# EAGLE design Arduino LCD Clock rev 2 (EAGLE 6.5.0)
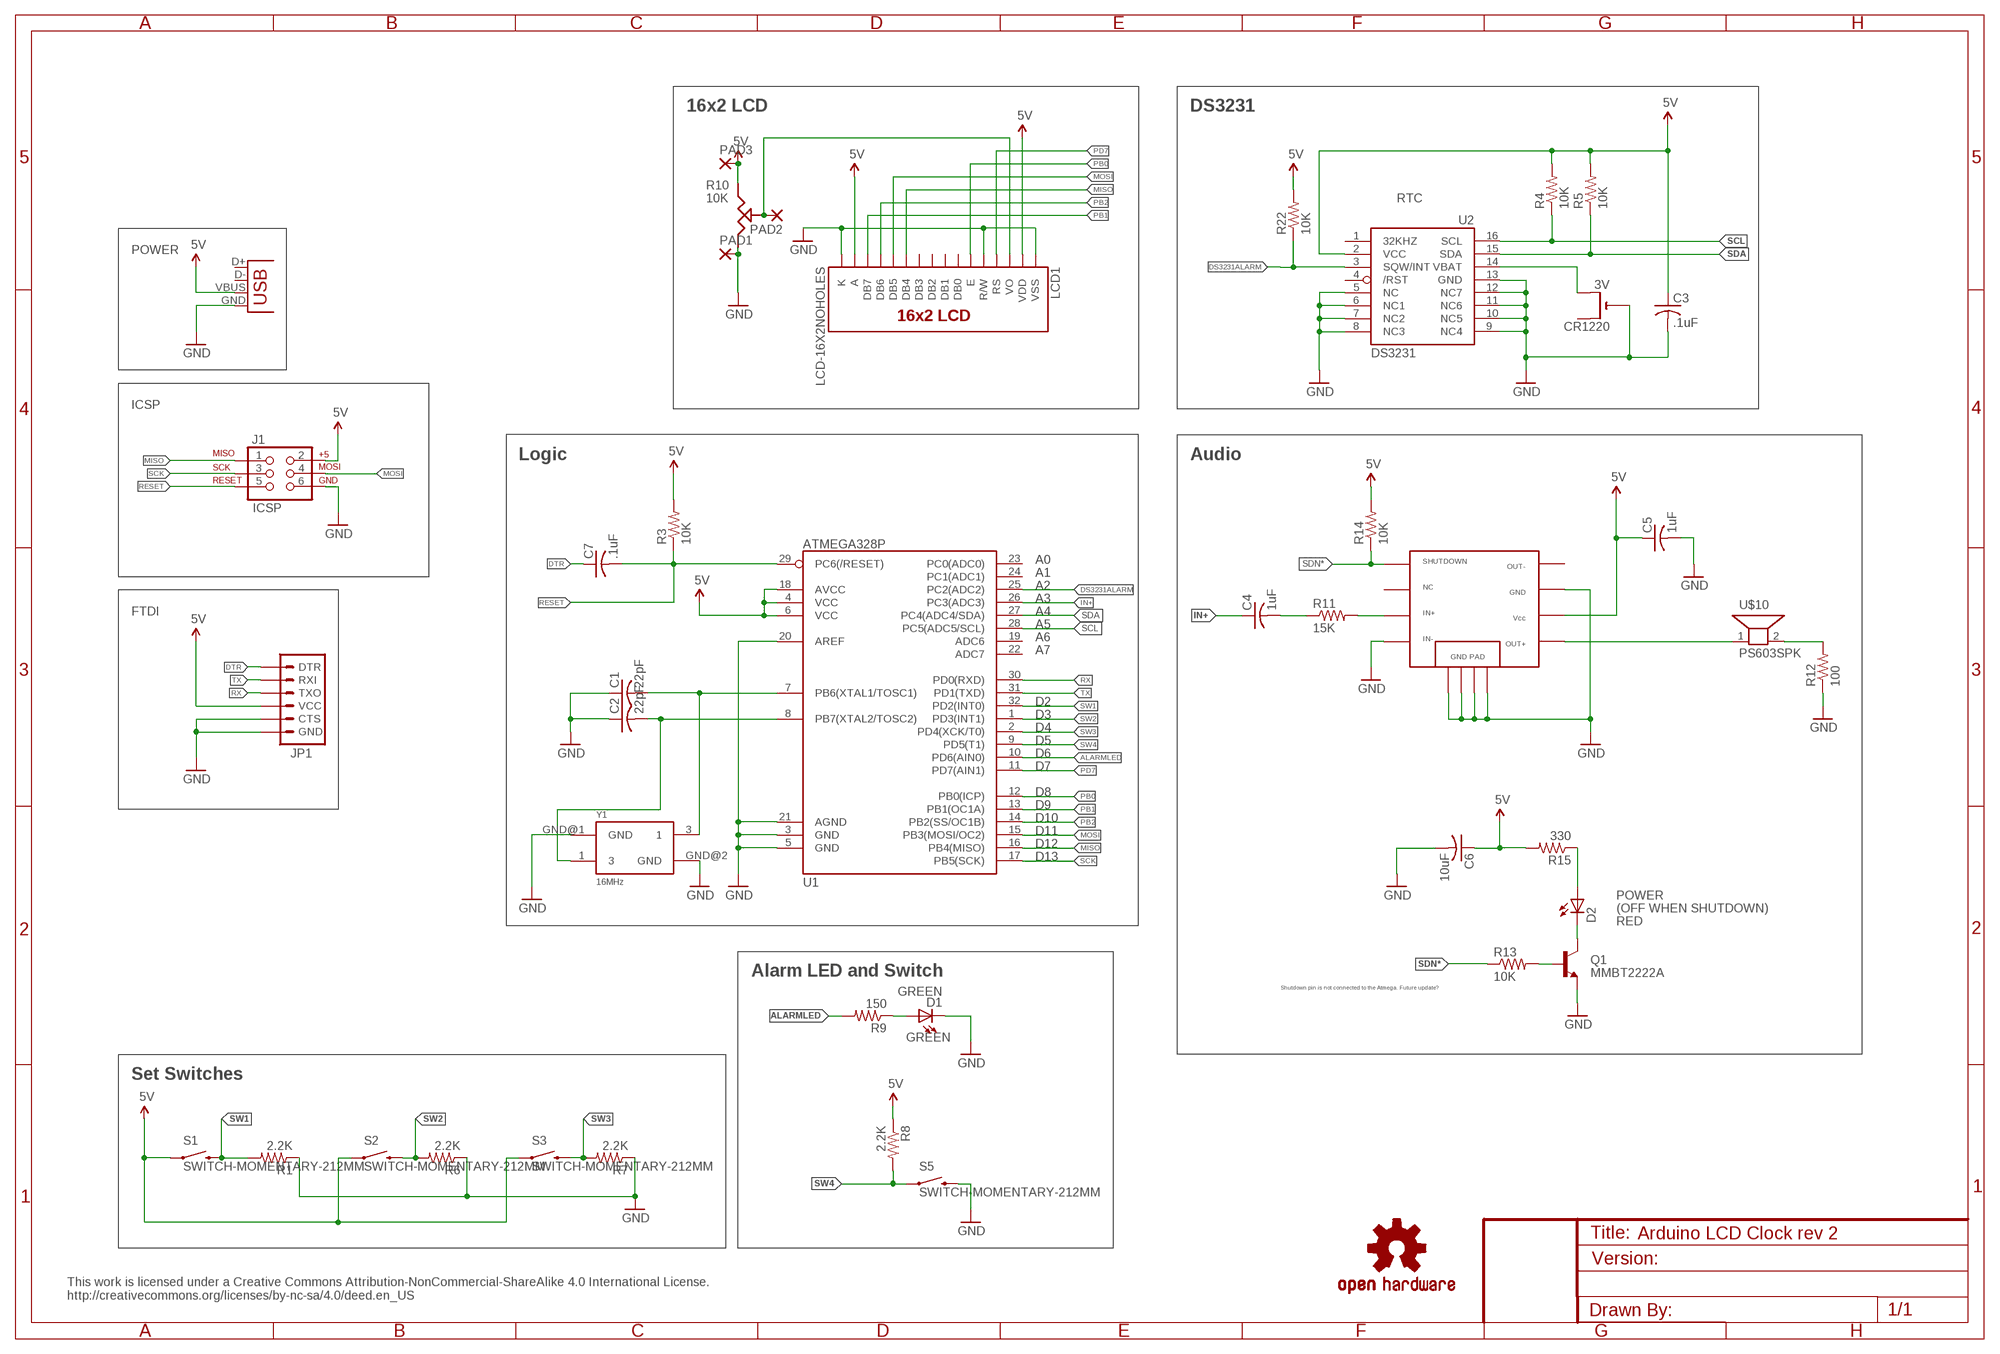
[diagram p0: schematic, sheet 1]

## Parts
C1  22pF  C-USC0805K  [C0805K]
C2  22pF  C-USC0805K  [C0805K]
C3  .1uF  C-USC0805K  [C0805K]
C4  1uF  C-USC0805K  [C0805K]
C5  1uF  C-USC0805K  [C0805K]
C6  10uF  C-USC0805K  [C0805K]
C7  .1uF  C-USC0805K  [C0805K]
CR1220  3V  CR1220THM  [CR1220-THM]
D1  GREEN  LED-RED1206  [LED-1206]
D2  LED-RED1206  [LED-1206]
J1  ICSP  AVR_SPI_PRG_6PTH  [2X3]
JP1  ARDUINO_SERIAL_PROGRAMSMD  [1X06-SMD]
JP3  (POWER ONLY)  USBPTH-VERTICAL  [USB-B-PTH-VERTICAL]
LCD1  LCD-16X2NOHOLES  [LCD-16X2_NOHOLES]
PAD1  SMD2  [SMD1,27-2,54]
PAD2  SMD2  [SMD1,27-2,54]
PAD3  SMD2  [SMD1,27-2,54]
Q1  MMBT2222A  TRANSISTOR_NPNSOT23-3  [SOT23-3]
R1  2.2K  R-US_R0805  [R0805]
R3  10K  R-US_R0805  [R0805]
R4  10K  R-US_R0805  [R0805]
R5  10K  R-US_R0805  [R0805]
R6  2.2K  R-US_R0805  [R0805]
R7  2.2K  R-US_R0805  [R0805]
R8  2.2K  R-US_R0805  [R0805]
R9  150  R-US_R0805  [R0805]
R11  15K  R-US_R0805  [R0805]
R12  100  R-US_R0805  [R0805]
R13  10K  R-US_R0805  [R0805]
R14  10K  R-US_R0805  [R0805]
R15  330  R-US_R0805  [R0805]
R22  10K  R-US_R0805  [R0805]
S1  SWITCH-MOMENTARY-212MM  [TACTILE-PTH-12MM]
S2  SWITCH-MOMENTARY-212MM  [TACTILE-PTH-12MM]
S3  SWITCH-MOMENTARY-212MM  [TACTILE-PTH-12MM]
S5  SWITCH-MOMENTARY-212MM  [TACTILE-PTH-12MM]
U1  ATMEGA328P  ATMEGA328_SMT  [TQFP32-08]
U2  DS3231  DS3231/SO  [SO16W]
U3  TPA2005  [MSOP8]
U$2  OSHW-LOGOM  [OSHW-LOGO-M]
U$6  PVG3A103C01R00_TRIMPOT  [PVG3A103C01R00_TRIMPOT]
U$10  PS603SPK  [PS603]
Y1  16MHz  OSCILLATOR5X3  [CRYSTAL-SMD-5X3]

## Nets
5V: C3.1 C5.1 C6.1 J1.2 JP1.4(VCC) JP3.VBUS LCD1.2(VDD) LCD1.15(A) PAD3.1(P) R3.2 R4.2 R5.2 R8.1 R14.2 R15.2 R22.2 S1.1 S2.1 S3.1 U1.4(VCC) U1.6(VCC) U1.18(AVCC) U2.2(VCC) U3.6 U$6.1$(IN) U$6.1(IN)
ALARMLED: R9.2 U1.10(PD6(AIN0))
DS3231ALARM: R22.1 U1.25(PC2(ADC2)) U2.3(SQW/INT)
DTR: C7.1 JP1.1(DTR)
GND: C1.1 C2.1 C3.2 C5.2 C6.2 CR1220.- D1.C J1.6 JP1.5(CTS) JP1.6(GND) JP3.GND LCD1.1(VSS) LCD1.5(R/W) LCD1.16(K) PAD1.1(P) Q1.2(E) R1.1 R6.1 R7.1 R12.1 S5.3 U1.3(GND) U1.5(GND) U1.20(AREF) U1.21(AGND) U2.5(NC) U2.6(NC1) U2.7(NC2) U2.8(NC3) U2.9(NC4) U2.10(NC5) U2.11(NC6) U2.12(NC7) U2.13(GND) U3.4 U3.7 U3.A U3.B U3.C U3.D U$6.3$(GND) U$6.3(GND) Y1.GND@1(GND) Y1.GND@2(GND)
IN+: C4.1 U1.26(PC3(ADC3))
IN+AMP: R11.2 U3.3
MISO: J1.1 LCD1.11(DB4) U1.16(PB4(MISO))
MOSI: J1.4 LCD1.12(DB5) U1.15(PB3(MOSI/OC2))
N$1: CR1220.+2(+1) U2.14(VBAT)
N$2: U3.5 U$10.1
N$13: LCD1.3(VO) PAD2.1(P) U$6.2!(OUT) U$6.2(OUT)
N$20: R12.2 U$10.2
N$24: D1.A R9.1
N$25: D2.A R15.1
N$26: Q1.1(B) R13.2
N$27: D2.C Q1.3(C)
N$28: C4.2 R11.1
N$30: C1.2 U1.7(PB6(XTAL1/TOSC1)) Y1.3
N$31: C2.2 U1.8(PB7(XTAL2/TOSC2)) Y1.1
PB0: LCD1.6(E) U1.12(PB0(ICP))
PB1: LCD1.14(DB7) U1.13(PB1(OC1A))
PB2: LCD1.13(DB6) U1.14(PB2(SS/OC1B))
PD7: LCD1.4(RS) U1.11(PD7(AIN1))
RESET: C7.2 J1.5 R3.1 U1.29(PC6(/RESET))
RX: JP1.3(TXO) U1.30(PD0(RXD))
SCK: J1.3 U1.17(PB5(SCK))
SCL: R4.1 U1.28(PC5(ADC5/SCL)) U2.16(SCL)
SDA: R5.1 U1.27(PC4(ADC4/SDA)) U2.15(SDA)
SDN*: R13.1 R14.1 U3.1
SW1: R1.2 S1.3 U1.32(PD2(INT0))
SW2: R6.2 S2.3 U1.1(PD3(INT1))
SW3: R7.2 S3.3 U1.2(PD4(XCK/T0))
SW4: R8.2 S5.1 U1.9(PD5(T1))
TX: JP1.2(RXI) U1.31(PD1(TXD))
Unconnected: CR1220.+1(+) JP3.D+ JP3.D- LCD1.7(DB0) LCD1.8(DB1) LCD1.9(DB2) LCD1.10(DB3) U1.19(ADC6) U1.22(ADC7) U1.23(PC0(ADC0)) U1.24(PC1(ADC1)) U2.1(32KHZ) U2.4(/RST) U3.8 U3.NC

## Notes on the sheet
- 16x2 LCD | DS3231
- R10
- 10K | RTC
- POWER
- ICSP
- Logic | Audio
- A0
- A1
- A2
- A3
- FTDI | A4
- A5
- A6
- A7
- D2
- D3
- D4
- D5
- D6
- D7
- D8
- D9
- D10
- D11
- D12
- D13
- POWER
- (OFF WHEN SHUTDOWN)
- RED
- Alarm LED and Switch
- Shutdown pin is not connected to the Atmega. Future update?
- GREEN
- Set Switches
- This work is licensed under a Creative Commons Attribution-NonCommercial-ShareAlike 4.0 International License.
  http://creativecommons.org/licenses/by-nc-sa/4.0/deed.en_US

## Library data of the parts
C1-C7 = adafruit:C-US: CAPACITOR, American symbol
CR1220 = adafruit:CR1220: CR1216/CR1220/CR1225 12mm 3V lithium coin cell Great for battery packup. Both SMT and THM holders. Note the THM package has the ground pads on both sides of the PCB so that the masks are the same - this reduces the cost
D1 D2 = SparkFun-LED:LED-RED: Assorted Red LEDs LilyPad 1206- DIO-09912 1206- DIO-00809 0603- DIO-00819; PROD_ID: DIO-00809; VALUE: RED
J1 = SparkFun:AVR_SPI_PRG_6: AVR ISP 6 Pin This is the reduced ISP connector for AVR programming. Common on Arduino. This footprint will take up less PCB space and can be used with a 10-pin to 6-pin adapter such as SKU: BOB-08508; OC_NEWARK: unknown
JP1 = SparkFun-Connectors:ARDUINO_SERIAL_PROGRAM: FTDI connector footprints
JP3 = SparkFun-Connectors:USB: USB Connectors USB-B-PTH is fully proven SKU : PRT-00139/CONN-08278 USB-miniB is fully proven SKU : PRT-00587 USB-A-PCB is untested. USB-A-H is throughly reviewed, but untested. Spark Fun Electronics SKU : PRT-00437 USB-B-SMT is throughly reviewed, but untested. Needs silkscreen touching up. USB-A-S has not been used/tested USB-MB-H has not been used/tested USB-MICROB has been used. CONN-09505
LCD1 = SparkFun-Displays:LCD-16X2: Standard text-only 16x2 parallel input LCD
PAD1-PAD3 = wirepad:SMD2: SMD PAD
Q1 = SparkFun:TRANSISTOR_NPN: Transistor NPN BJT configuration in SOT23 package. MMBT2222 is the common NPN we use. Double check BCE configuration again layout.
R1 R3-R9 R11-R15 R22 = adafruit:R-US_: RESISTOR, American symbol
S1-S3 S5 = SparkFun-Electromechanical:SWITCH-MOMENTARY-2: Various NO switches- pushbuttons, reed, etc; PROD_ID: SWCH-09185
U1 = SparkFun-DigitalIC:ATMEGA328_SMT: 32-Pin Atmega328 part Commonly used on Arduino compatible boards Available in QFP and QFN packages TQFP is IC-09069 QFN is non-stock; PROD_ID: IC-09069
U2 = adafruit:DS3231
U3 = TPA2005:TPA2005
U$2 = SparkFun:OSHW-LOGO: Open Source Hardware Logo This logo indicates the piece of hardware it is found on incorporates a OSHW license and/or adheres to the definition of open source hardware found here: http://freedomdefined.org/OSHW
U$6 = minipot:PVG3A103C01R00_TRIMPOT
U$10 = adafruit:PS603: PS603 Small 8 ohm speaker, from Mouser. Can SMT solder to board http://www.ladyada.net/library/pcb/eaglelibrary.html
Y1 = SparkFun-FreqCtrl:OSCILLATOR: Generic 5x3 and 7x5 oscillators

## Board
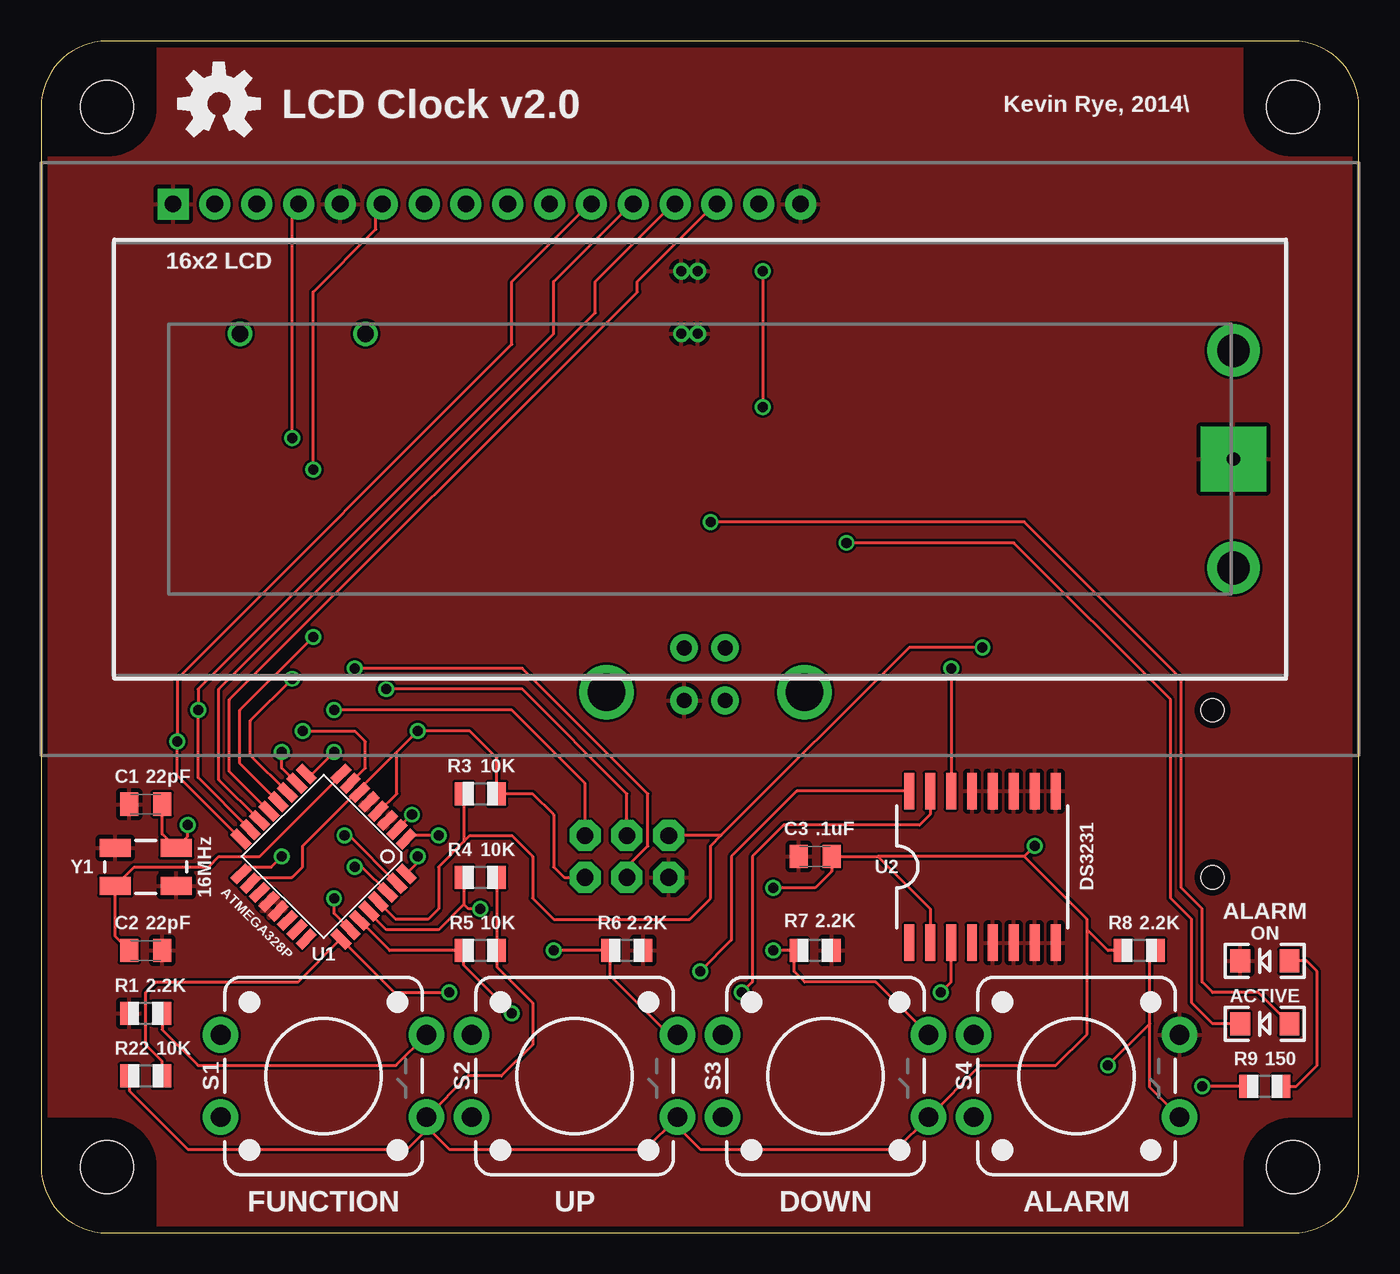
[diagram p1: board, top side]
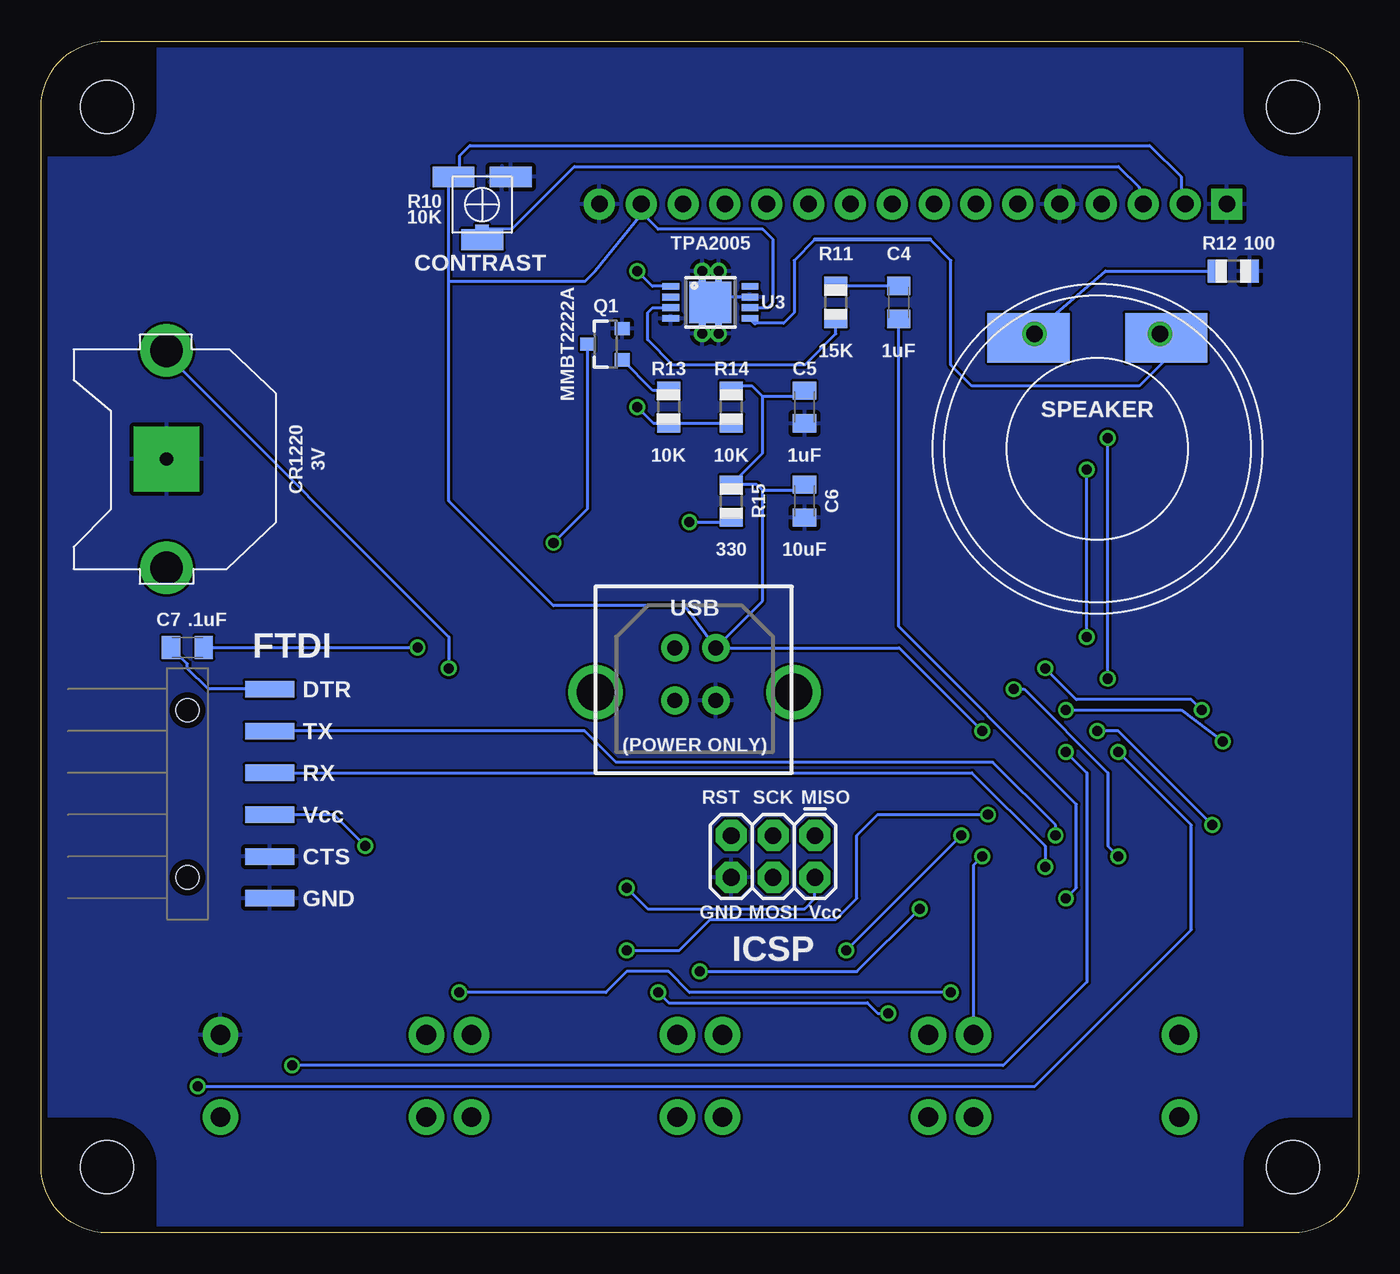
[diagram p2: board, bottom side, seen from below]

Size 80 x 72.38 mm. Coordinates in mm from the lower left corner, seen from the top.
Copper layers (1*16): Top 0.0356mm / dielectric 1.5011mm / Bottom 0.0356mm
Design rules "LaenPCBOrder": minimum track width 6mil, minimum drill 13mil, track to track 6mil, track to pad 6mil, pad to pad 6mil, via to via 6mil, smd to smd 6mil, copper to edge 15mil, drill to drill 6mil, minimum pad ring 7mil, minimum via ring 7mil, stop-mask expansion 3mil, vias tented up to drill 0mil, thermal gap 10mil

### Footprints (pad centres in the part's own frame; a part is rotated, then mirrored left to right if it is on the bottom)
C0805K = smd 1.1 x 1.4: 1 -1,0; 2 1,0
CR1220-THM = drill 2 pad 3.175: +1 -6.604,0; +2 6.604,0 | drill 0.8 pad 3.962 square: - 0,0
LED-1206 = smd 1.2 x 1.4: A -1.5,0; C 1.5,0
2X3 = drill 1.016 pad 1.88 octagon: 1 0,0; 2 0,2.54; 3 2.54,0; 4 2.54,2.54; 5 5.08,0; 6 5.08,2.54
1X06-SMD = smd 1 x 3: 1 -6.35,5; 2 -3.81,5; 3 -1.27,5; 4 1.27,5; 5 3.81,5; 6 6.35,5 | hole 1.4: -5.08,0; 5.08,0
USB-B-PTH-VERTICAL = drill 0.914 pad 1.676: D+ 4.826,4.394; D- 4.826,7.595; GND 7.315,4.394; VBUS 7.315,7.595 | drill 2.286: P$1 0,4.902; P$2 12.04,4.902
LCD-16X2_NOHOLES = drill 1.016 pad 1.88 square: 1 -32,15.5 | drill 1.016 pad 1.88: 2 -29.46,15.5; 3 -26.92,15.5; 4 -24.38,15.5; 5 -21.84,15.5; 6 -19.3,15.5; 7 -16.76,15.5; 8 -14.22,15.5; 9 -11.68,15.5; 10 -9.14,15.5; 11 -6.6,15.5; 12 -4.06,15.5; 13 -1.52,15.5; 14 1.02,15.5; 15 3.56,15.5; 16 6.1,15.5
SMD1,27-2,54 = smd 1.27 x 2.54: 1 0,0
SOT23-3 = smd 0.8 x 0.9: 1 -0.95,-1; 2 0.95,-1; 3 0,1.1
R0805 = smd 1.1 x 1.4: 1 -1,0; 2 1,0
TACTILE-PTH-12MM = drill 1.2 pad 2.159: 1 6.25,-2.5; 2 -6.25,-2.5; 3 6.25,2.5; 4 -6.25,2.5
TQFP32-08 = smd 1.27 x 0.559: 1 -4.293,2.8; 2 -4.293,2; 3 -4.293,1.2; 4 -4.293,0.4; 5 -4.293,-0.4; 6 -4.293,-1.2; 7 -4.293,-2; 8 -4.293,-2.8; 17 4.293,-2.8; 18 4.293,-2; 19 4.293,-1.2; 20 4.293,-0.4; 21 4.293,0.4; 22 4.293,1.2; 23 4.293,2; 24 4.293,2.8 | smd 0.559 x 1.27: 9 -2.8,-4.293; 10 -2,-4.293; 11 -1.2,-4.293; 12 -0.4,-4.293; 13 0.4,-4.293; 14 1.2,-4.293; 15 2,-4.293; 16 2.8,-4.293; 25 2.8,4.293; 26 2,4.293; 27 1.2,4.293; 28 0.4,4.293; 29 -0.4,4.293; 30 -1.2,4.293; 31 -2,4.293; 32 -2.8,4.293
SO16W = smd 0.6 x 2.2: 1 -4.445,-4.6; 2 -3.175,-4.6; 3 -1.905,-4.6; 4 -0.635,-4.6; 5 0.635,-4.6; 6 1.905,-4.6; 7 3.175,-4.6; 8 4.445,-4.6; 9 4.445,4.6; 10 3.175,4.6; 11 1.905,4.6; 12 0.635,4.6; 13 -0.635,4.6; 14 -1.905,4.6; 15 -3.175,4.6; 16 -4.445,4.6
MSOP8 = smd 0.41 x 1.02: 1 -0.975,-2.4; 3 0.325,-2.4; 4 0.975,-2.4; 5 0.975,2.4; 6 0.325,2.4; 7 -0.325,2.4; 8 -0.975,2.4; NC -0.325,-2.4 | smd 1.02 x 0.41: 2 -1.13,0.5; 9 -1.13,-0.5; 10 1.13,-0.5; 11 1.13,0.5 | drill 0.61 pad 1.016: A -1.9,-0.5; B 1.91,-0.5; C 1.91,0.5; D -1.9,0.5 | smd 2.54 x 1.27: GND 0,0.635; GND1 0,0.635; GND* 0,-0.635
LCD_V2_FOOTPRINT = hole 3.2: 3.365,4; 75.365,4; 75.365,68.38; 3.365,68.38
PVG3A103C01R00_TRIMPOT = smd 0.813 x 0.406: 1 3,-0.1; 1$ 3,0.3; 2 1.8,3.5; 2! 1.8,3.1; 3 0.6,-0.1; 3$ 0.6,0.3
PS603 = smd 5 x 3: 1 -4.184,-6.738; 2 4.184,-6.738
CRYSTAL-SMD-5X3 = smd 1.9 x 1.1: 1 -1.85,-1.15; 3 1.85,1.15; GND@1 -1.85,1.15; GND@2 1.85,-1.15

### Placement (x,y rotation side)
C1  6.35,26.03 0 top
C2  6.35,17.14 180 top
C3  46.99,22.86 180 top
C4  27.94,56.52 90 bottom
C5  33.66,50.16 270 bottom
C6  33.66,44.45 270 bottom
C7  71.12,35.56 0 bottom
CR1220  72.39,46.99 90 bottom
D1  74.3,16.51 180 top
D2  74.3,12.7 180 top
J1  33.02,24.13 180 bottom
JP1  71.12,26.67 270 bottom
JP3  46.35,27.94 0 bottom
LCD1  40.01,46.99 0 top
PAD1  51.49,64.13 270 bottom
PAD2  53.21,60.33 90 bottom
PAD3  54.97,64.13 270 bottom
Q1  45.72,53.98 90 bottom
R1  6.35,13.34 0 top
R3  26.67,26.67 0 top
R4  26.67,21.59 0 top
R5  26.67,17.14 0 top
R6  35.56,17.14 180 top
R7  46.99,17.14 180 top
R8  66.67,17.14 0 top
R9  74.3,8.89 180 top
R11  31.75,56.52 270 bottom
R12  7.62,58.42 180 bottom
R13  41.91,50.16 90 bottom
R14  38.1,50.16 90 bottom
R15  38.1,44.45 90 bottom
R22  6.35,9.52 180 top
S1  17.14,9.52 0 top
S2  32.38,9.52 0 top
S3  47.62,9.52 0 top
S5  62.87,9.52 0 top
U1  17.14,22.86 225 top
U2  57.15,22.23 0 top
U3  39.37,56.52 270 bottom
U$2  10.79,68.58 0 top
U$5  [LCD_V2_FOOTPRINT]  0.64,0 0 top
U$6  51.44,64.13 180 bottom
U$10  15.88,47.62 180 bottom
Y1  6.35,22.23 0 top

### Tracks (layer width: path | path; a pad name or v marks a point on that pad's centre or on a via)
5V  (via drill 0.61)
  Top 0.178: 50.8,22.86 C3.1 47.99,21.95 46.99,20.95 v44.45,20.95 | 50.8,22.86 53.98,19.69 U2.2 | R8.1 64.77,17.14 63.5,18.41 | 63.5,18.41 63.5,19.05 59.69,22.86 | 59.69,22.86 50.8,22.86 | v60.33,23.49 59.69,22.86 | 63.5,18.41 63.5,12.06 61.59,10.16 57.01,10.16 S3.1 51.93,5.08 40.01,5.08 38.63,6.45 S2.1 36.69,5.08 24.77,5.08 23.5,6.35 | J1.2 31.75,21.59 31.11,22.23 31.11,25.4 29.84,26.67 R3.2 | R3.2 27.94,26.94 | 23.5,6.35 23.39,6.45 S1.1 25.89,9.52 27.94,9.52 29.84,11.43 29.84,13.97 27.67,16.14 R5.2 R4.2 | 21.59,29.21 v22.86,30.48 26.04,30.48 27.67,28.84 R3.2 | 21.59,29.21 19.33,26.95 U1.6 19.12,26.74 15.88,23.49 15.88,22.23 15.24,21.59 13.05,21.59 U1.18 | U1.4 20.53,25.61 21.59,26.67 21.59,29.21 | 5.08,9.52 R22.2 5.35,8.62 8.89,5.08 22.23,5.08 23.5,6.35
  Bottom 0.178: LCD1.2 10.79,62.74 10.79,64.13 12.7,66.04 53.98,66.04 54.61,65.41 54.61,64.41 U$6.1 | U3.6 35.88,56.19 35.56,56.52 35.56,60.33 36.2,60.96 42.55,60.96 43.56,61.98 | JP1.4 62.23,25.4 v60.33,23.49 | JP3.VBUS 36.2,38.38 36.2,45.09 | 36.2,45.09 36.56,45.45 R15.2 36.2,47.36 36.2,50.8 | C6.1 34.02,45.09 36.2,45.09 | 36.2,50.8 36.83,51.44 37.83,51.44 R14.2 | C5.1 34.02,50.8 36.2,50.8 | v44.45,20.95 43.18,19.69 33.66,19.69 33.02,20.32 J1.2 | JP3.VBUS 27.91,35.53 v22.86,30.48 | JP3.VBUS 40.97,38.1 48.9,38.1 55.24,44.45 55.24,57.79 | U$6.1 U$6.1$ 55.24,63.66 55.24,57.79 | 43.56,61.98 43.56,61.84 46.35,58.42 46.99,57.79 55.24,57.79 | 43.56,61.98 LCD1.15 | U$6.1 54.51,64.23 PAD3.1
ALARMLED  (via drill 0.61)
  Top 0.178: R9.2 v70.48,8.89 | U1.10 14.61,28.23 v14.61,29.21
  Bottom 0.178: v70.48,8.89 19.68,8.89 10.16,18.41 10.16,24.77 v14.61,29.21
DS3231ALARM  (via drill 0.61)
  Top 0.178: v24.77,14.61 21.44,14.61 U1.25 15.6,15.24 6.99,15.24 6.35,14.61 6.35,11.43 7.35,10.43 R22.1 | v54.61,14.61 55.24,15.24 U2.3
  Bottom 0.178: v24.77,14.61 40.64,14.61 41.91,15.88 44.45,15.88 45.72,14.61 v54.61,14.61
DTR
  Bottom 0.178: JP1.1 69.85,33.02 71.12,34.29 71.12,34.56 C7.1
GND
  Bottom 0.178: U3.7 38.87,56.84 U3.D | 52.03,64.17 U$6.3 52.07,64.2 PAD1.1 | PAD1.1 52.07,63.87 U$6.3$ 52.03,64.1 PAD1.1
  pour Top: -1.27,73.66 81.28,73.66 81.28,-1.27 -1.27,-1.27
  pour Bottom: -0.64,73.02 80.64,73.02 80.64,-0.64 -0.64,-0.64
IN+  (via drill 0.61)
  Top 0.178: U1.26 17.78,19.4 v17.78,20.32
  Bottom 0.178: v17.78,20.32 17.14,20.95 17.14,26.03 27.94,36.83 C4.1
IN+AMP
  Bottom 0.178: U3.3 42.87,56.19 43.18,55.88 43.18,54.24 41.65,52.7 33.66,52.7 31.75,54.61 R11.2
MISO  (via drill 0.61)
  Top 0.178: LCD1.11 33.28,62.49 28.57,57.79 28.57,53.98 8.26,33.66 v8.26,29.84 8.26,27.79 U1.16 | J1.1 33.02,27.3 28.57,31.75 v17.78,31.75
  Bottom 0.178: v17.78,31.75 10.79,31.75 v8.26,29.84
MOSI  (via drill 0.61)
  Top 0.178: LCD1.12 35.82,62.49 31.11,57.79 31.11,54.61 9.53,33.02 v9.53,31.75 9.53,27.65 U1.15 | J1.4 35.56,22.23 36.83,23.49 36.83,26.67 29.21,34.29 v19.05,34.29
  Bottom 0.178: v9.53,31.75 10.16,32.38 17.14,32.38 v19.05,34.29
N$1  (via drill 0.61)
  Top 0.178: v55.24,34.29 U2.14
  Bottom 0.178: CR1220.+2 72.39,53.34 55.24,36.2 v55.24,34.29
N$2
  Bottom 0.178: 11.69,53.08 13.34,51.44 23.5,51.44 24.77,52.7 24.77,59.05 26.04,60.33 | 33.02,60.33 34.29,59.05 34.29,55.88 34.92,55.25 36.67,55.25
  Bottom 0.254: U$10.1 11.69,53.08 | 26.04,60.33 33.02,60.33 | 36.67,55.25 U3.5
N$3  (via drill 1)
  other vias: 12.06,54.61
N$4  (via drill 1)
  other vias: 19.68,54.61
N$13
  Bottom 0.178: LCD1.3 13.34,62.74 13.34,63.5 14.61,64.77 47.62,64.77 51.44,60.96 53.16,60.96 | 53.16,60.96 U$6.2! | 53.16,60.96 53.16,60.71 U$6.2 53.34,60.53 PAD2.1
N$20
  Bottom 0.178: U$10.2 15.37,58.42 R12.2
N$24
  Top 0.178: R9.1 75.3,9.25 75.66,8.89 76.2,8.89 77.47,10.16 77.47,15.88 76.83,16.51 D1.A
N$25  (via drill 0.61)
  Top 0.178: v40.64,43.18 59.69,43.18 69.22,33.66 69.22,20.95 70.48,19.69 70.48,15.24 71.12,14.61 73.89,14.61 D2.A
  Bottom 0.178: v40.64,43.18 38.1,43.18 R15.1
  Bottom 0.254: R15.1 38.2,43.7
N$26
  Bottom 0.178: R13.2 42.86,51.16 Q1.1
N$27  (via drill 0.61)
  Top 0.178: v48.9,41.91 59.05,41.91 68.58,32.38 68.58,20.32 69.85,19.05 69.85,13.97 71.12,12.7 D2.C
  Bottom 0.178: v48.9,41.91 46.82,43.98 Q1.3
N$28
  Bottom 0.178: C4.2 R11.1
N$30  (via drill 0.61)
  Top 0.178: C1.2 7.35,24.23 Y1.3 8.89,24.06 v8.89,24.77 | U1.7 19.68,28.23 19.68,29.84 19.05,30.48 v15.88,30.48
  Bottom 0.178: v8.89,24.77 14.61,30.48 v15.88,30.48
N$31
  Top 0.178: C2.2 4.5,17.99 Y1.1 5.65,22.23 10.16,22.23 10.79,22.86 13.27,22.86 18.2,27.79 U1.8
PB0  (via drill 0.61)
  Top 0.178: U1.12 12.06,28.51 12.06,31.75 v16.51,36.2 | v16.51,46.36 16.51,57.15 20.32,60.96 20.32,62.11 LCD1.6
  Bottom 0.178: v16.51,36.2 v16.51,46.36
PB1
  Top 0.178: LCD1.14 40.9,62.49 36.2,57.79 36.2,57.15 11.43,32.38 11.43,28.01 U1.13
PB2
  Top 0.178: LCD1.13 38.36,62.49 33.66,57.79 33.66,55.88 10.79,33.02 10.79,27.51 U1.14
PD7  (via drill 0.61)
  Top 0.178: U1.11 12.7,29 12.7,31.12 v15.24,33.66 | v15.24,48.26 15.24,62.11 LCD1.4
  Bottom 0.178: v15.24,33.66 v15.24,48.26
RESET  (via drill 0.61)
  Top 0.178: R3.1 25.67,23.77 | 25.67,23.77 24.13,22.23 24.13,19.69 23.5,19.05 21.52,19.05 U1.29 | v57.15,35.56 52.7,35.56 41.27,24.13 | 41.27,24.13 J1.5 | 25.67,23.77 26.04,24.13 28.57,24.13 29.84,22.86 29.84,20.32 31.11,19.05 39.37,19.05 40.64,20.32 40.64,23.49 41.27,24.13
  Bottom 0.178: C7.2 v57.15,35.56
RX  (via drill 0.61)
  Top 0.178: v19.05,22.23 19.48,22.23 U1.30
  Bottom 0.178: JP1.3 23.5,27.94 19.05,23.49 v19.05,22.23
SCK  (via drill 0.61)
  Top 0.178: J1.3 35.56,26.67 29.21,33.02 v20.95,33.02 | U1.17 arc-90 12.55,22.23 13.97,22.23 v14.61,22.86
  Bottom 0.178: v20.95,33.02 20.32,33.02 15.24,27.94 15.24,23.49 v14.61,22.86
SCL  (via drill 0.61)
  Top 0.178: R4.1 25.67,19.95 | 25.67,19.95 24.13,18.41 20.95,18.41 19.9,19.47 U1.28 | U2.16 45.88,26.83 41.91,22.86 41.91,17.78 v40.01,15.88 | v26.67,19.69 25.94,19.69 25.67,19.95
  Bottom 0.178: v40.01,15.88 30.48,15.88 v26.67,19.69
SDA  (via drill 0.61)
  Top 0.178: U1.27 21.16,17.14 R5.1 25.67,16.24 v28.57,13.34 | U2.15 53.98,25.4 53.34,24.77 45.09,24.77 43.18,22.86 43.18,15.24 v42.55,14.61
  Bottom 0.178: v42.55,14.61 41.91,13.97 29.84,13.97 29.21,13.34 v28.57,13.34
SDN*  (via drill 0.61)
  Top 0.178: v43.81,58.42 v43.81,50.16
  Bottom 0.178: U3.1 42.88,57.49 v43.81,58.42 | R14.1 R13.1 42.81,49.16 v43.81,50.16
SW1  (via drill 0.61)
  Top 0.178: R1.2 7.35,12.34 9.53,10.16 21.53,10.16 S1.3 | U1.32 22.86,22.5 v22.86,22.86
  Bottom 0.178: v22.86,22.86 23.39,22.32 S1.3
SW2  (via drill 0.61)
  Top 0.178: S2.3 38.14,12.02 34.56,15.61 R6.2 v31.11,17.14 | v24.13,24.13 22.58,24.13 U1.1
  Bottom 0.178: v31.11,17.14 v24.13,24.13
SW3  (via drill 0.61)
  Top 0.178: S3.3 50.66,15.24 46.35,15.24 45.72,15.88 45.72,17.14 R7.2 v44.45,17.14 | v22.51,25.4 U1.2
  Bottom 0.178: v44.45,17.14 41.27,17.14 39.37,19.05 31.75,19.05 30.48,20.32 30.48,24.13 29.21,25.4 v22.51,25.4
SW4  (via drill 0.61)
  Top 0.178: 67.31,12.7 67.31,17.14 R8.2 | v64.77,10.16 67.31,12.7 | S5.1 67.31,8.83 67.31,12.7 | U1.9 16.45,27.88 v17.78,29.21
  Bottom 0.178: v17.78,29.21 16.51,27.94 16.51,15.24 21.59,10.16 v64.77,10.16
TX  (via drill 0.61)
  Top 0.178: U1.31 18.7,24.13 v18.41,24.13
  Bottom 0.178: v18.41,24.13 18.41,24.77 22.23,28.58 45.09,28.58 46.99,30.48 JP1.2

### Text on the board
Unrouted: This work is licensed under a Creative Commons Attribution-NonCommercial-ShareAlike 4.0 International License. / http://creativecommons.org/licenses/by-nc-sa/4.0/deed.en_US
tPlace: ALARM | ON | ACTIVE | S1 | S2 | S3 | S4 | FUNCTION | UP | DOWN | ALARM
bPlace: FTDI | DTR | TX | RX | MISO | SCK | RST | Vcc | CTS | GND | Vcc | MOSI | GND
tNames: LCD Clock v2.0 | Kevin Rye, 2014\ | 16x2 LCD
bNames: R10 | 10K | CONTRAST | SPEAKER | USB